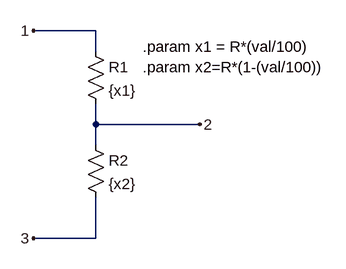
[diagram p0: schematic pot.asc]
pot.asc, the LTspice schematic file:
Version 4
SHEET 1 880 680
WIRE 160 32 64 32
WIRE 160 64 160 32
WIRE 160 176 160 144
WIRE 320 176 160 176
WIRE 160 208 160 176
WIRE 160 352 160 288
WIRE 160 352 64 352
FLAG 64 32 1
FLAG 320 176 2
FLAG 64 352 3
SYMBOL res 144 48 R0
SYMATTR InstName R1
SYMATTR Value {x1}
SYMBOL res 144 192 R0
SYMATTR InstName R2
SYMATTR Value {x2}
TEXT 232 56 Left 2 !.param x1 = R*(val/100)
TEXT 232 88 Left 2 !.param x2=R*(1-(val/100))

The netlist it stands for:
* pot.asc
R1 1 2 {x1}
R2 2 3 {x2}
.param x1 = R*(val/100)
.param x2=R*(1-(val/100))
.backanno
.end